# EAGLE schematic D-DAQ Mainboard - Revised (EAGLE 6.6.0)
D-DAQ PIC32MX-controlled modular data aquisition and display
REVISION: 1
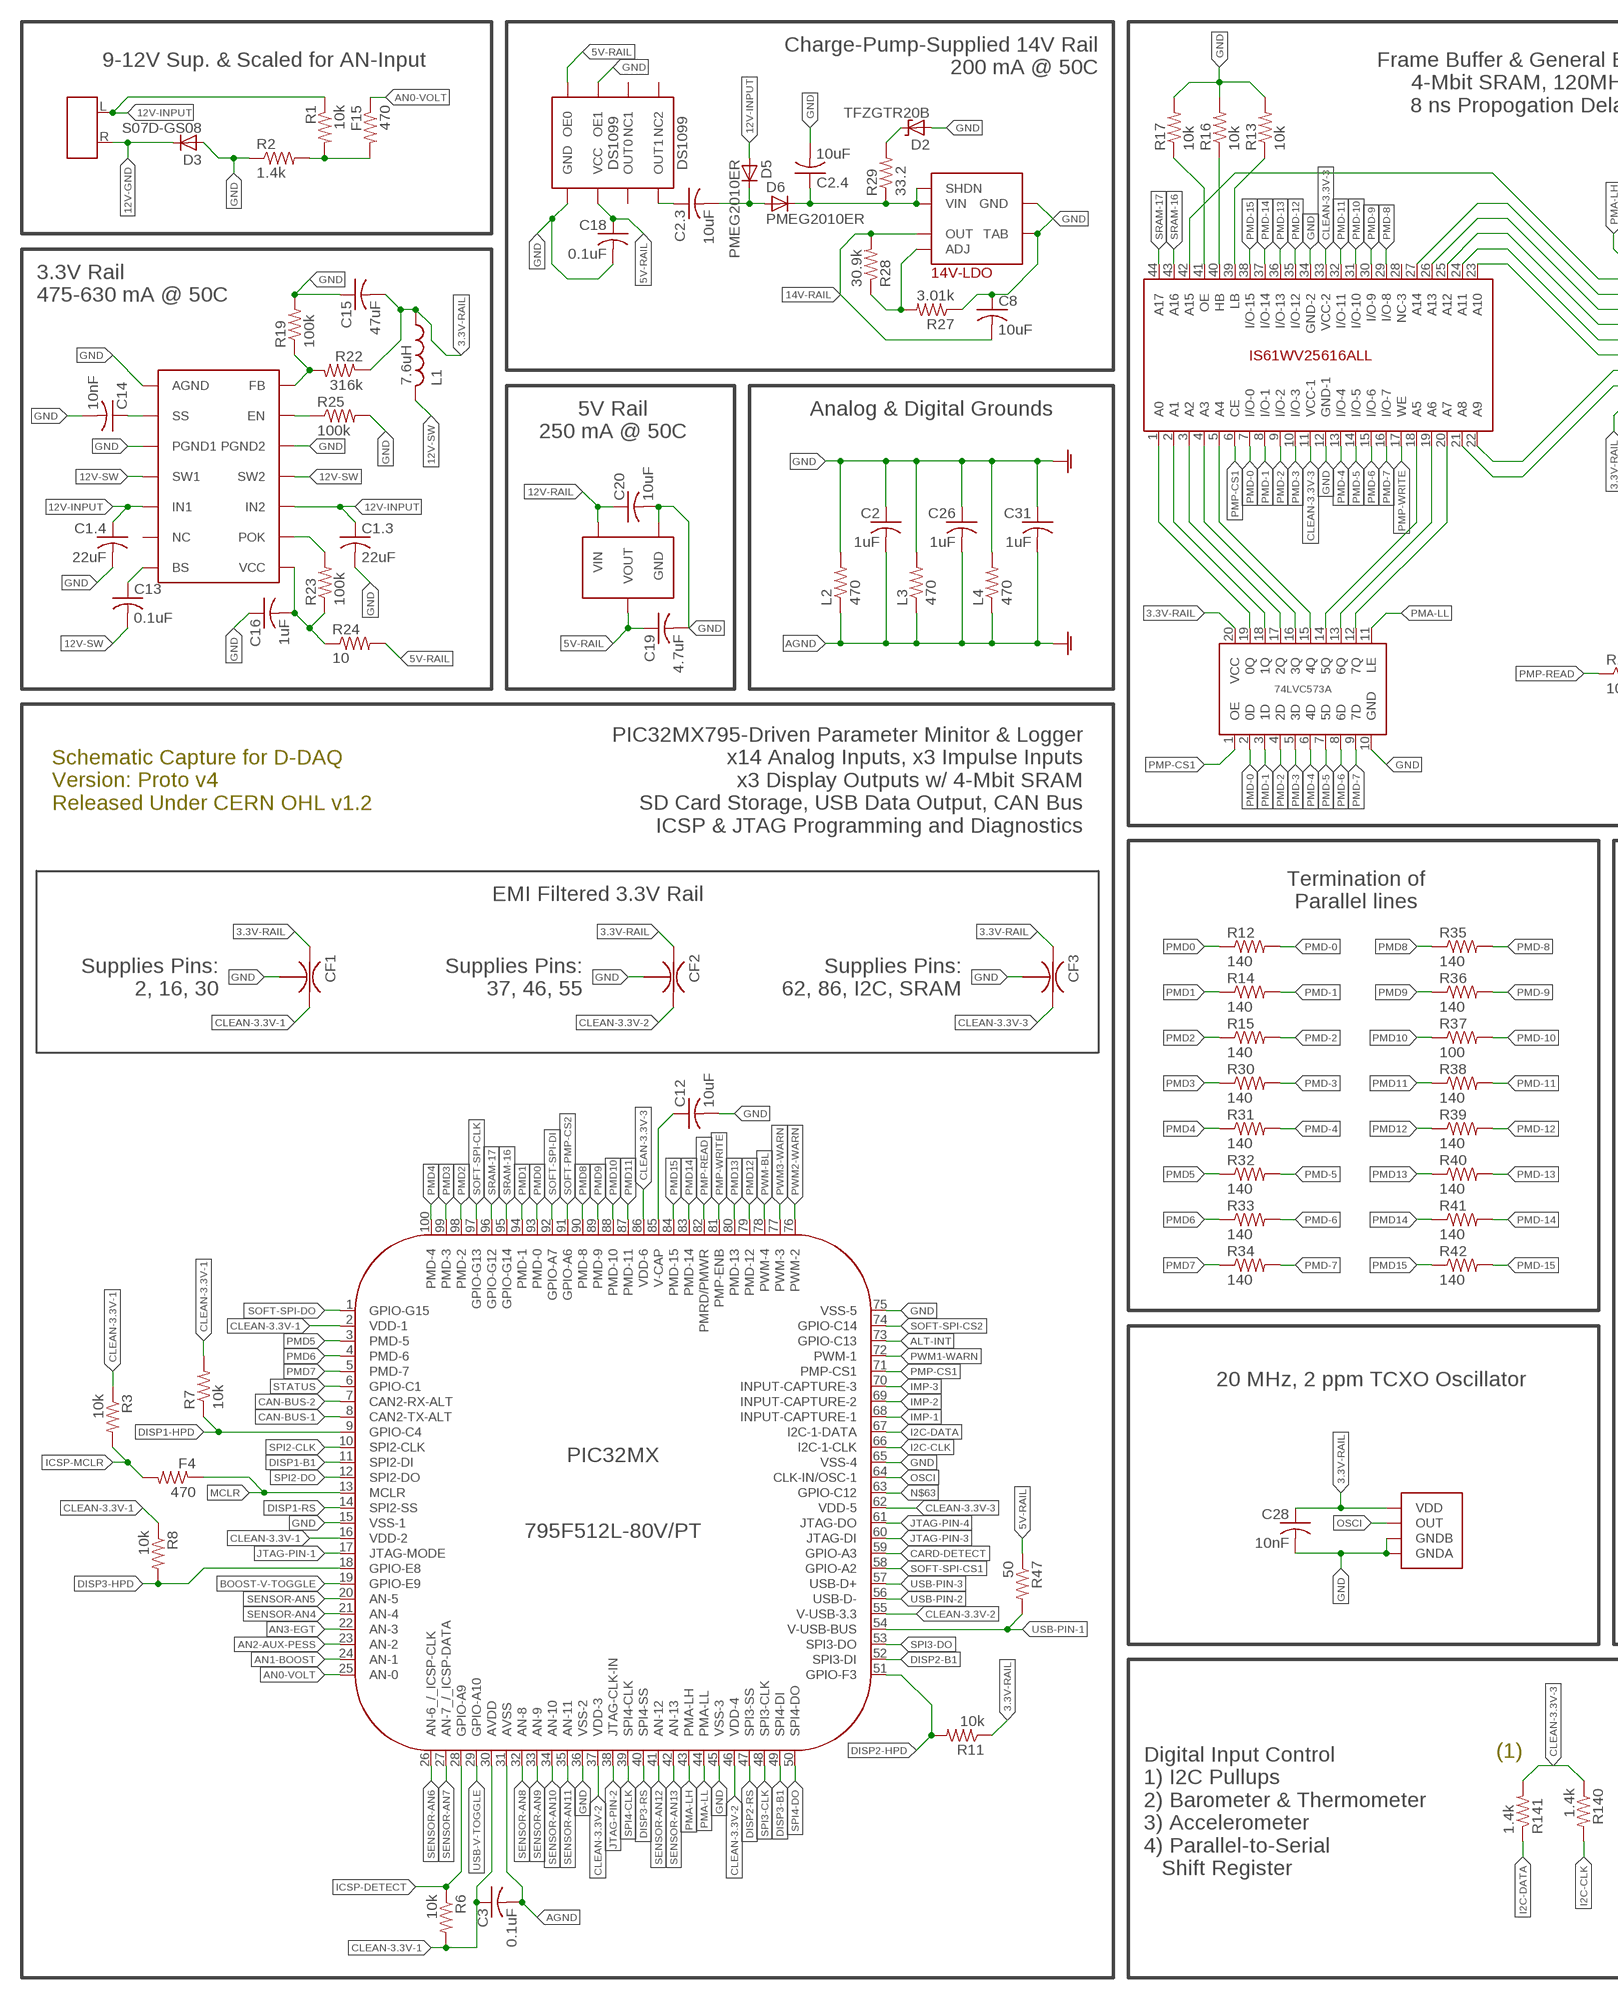
[diagram p0: schematic, sheet 1, part 1 of 2]
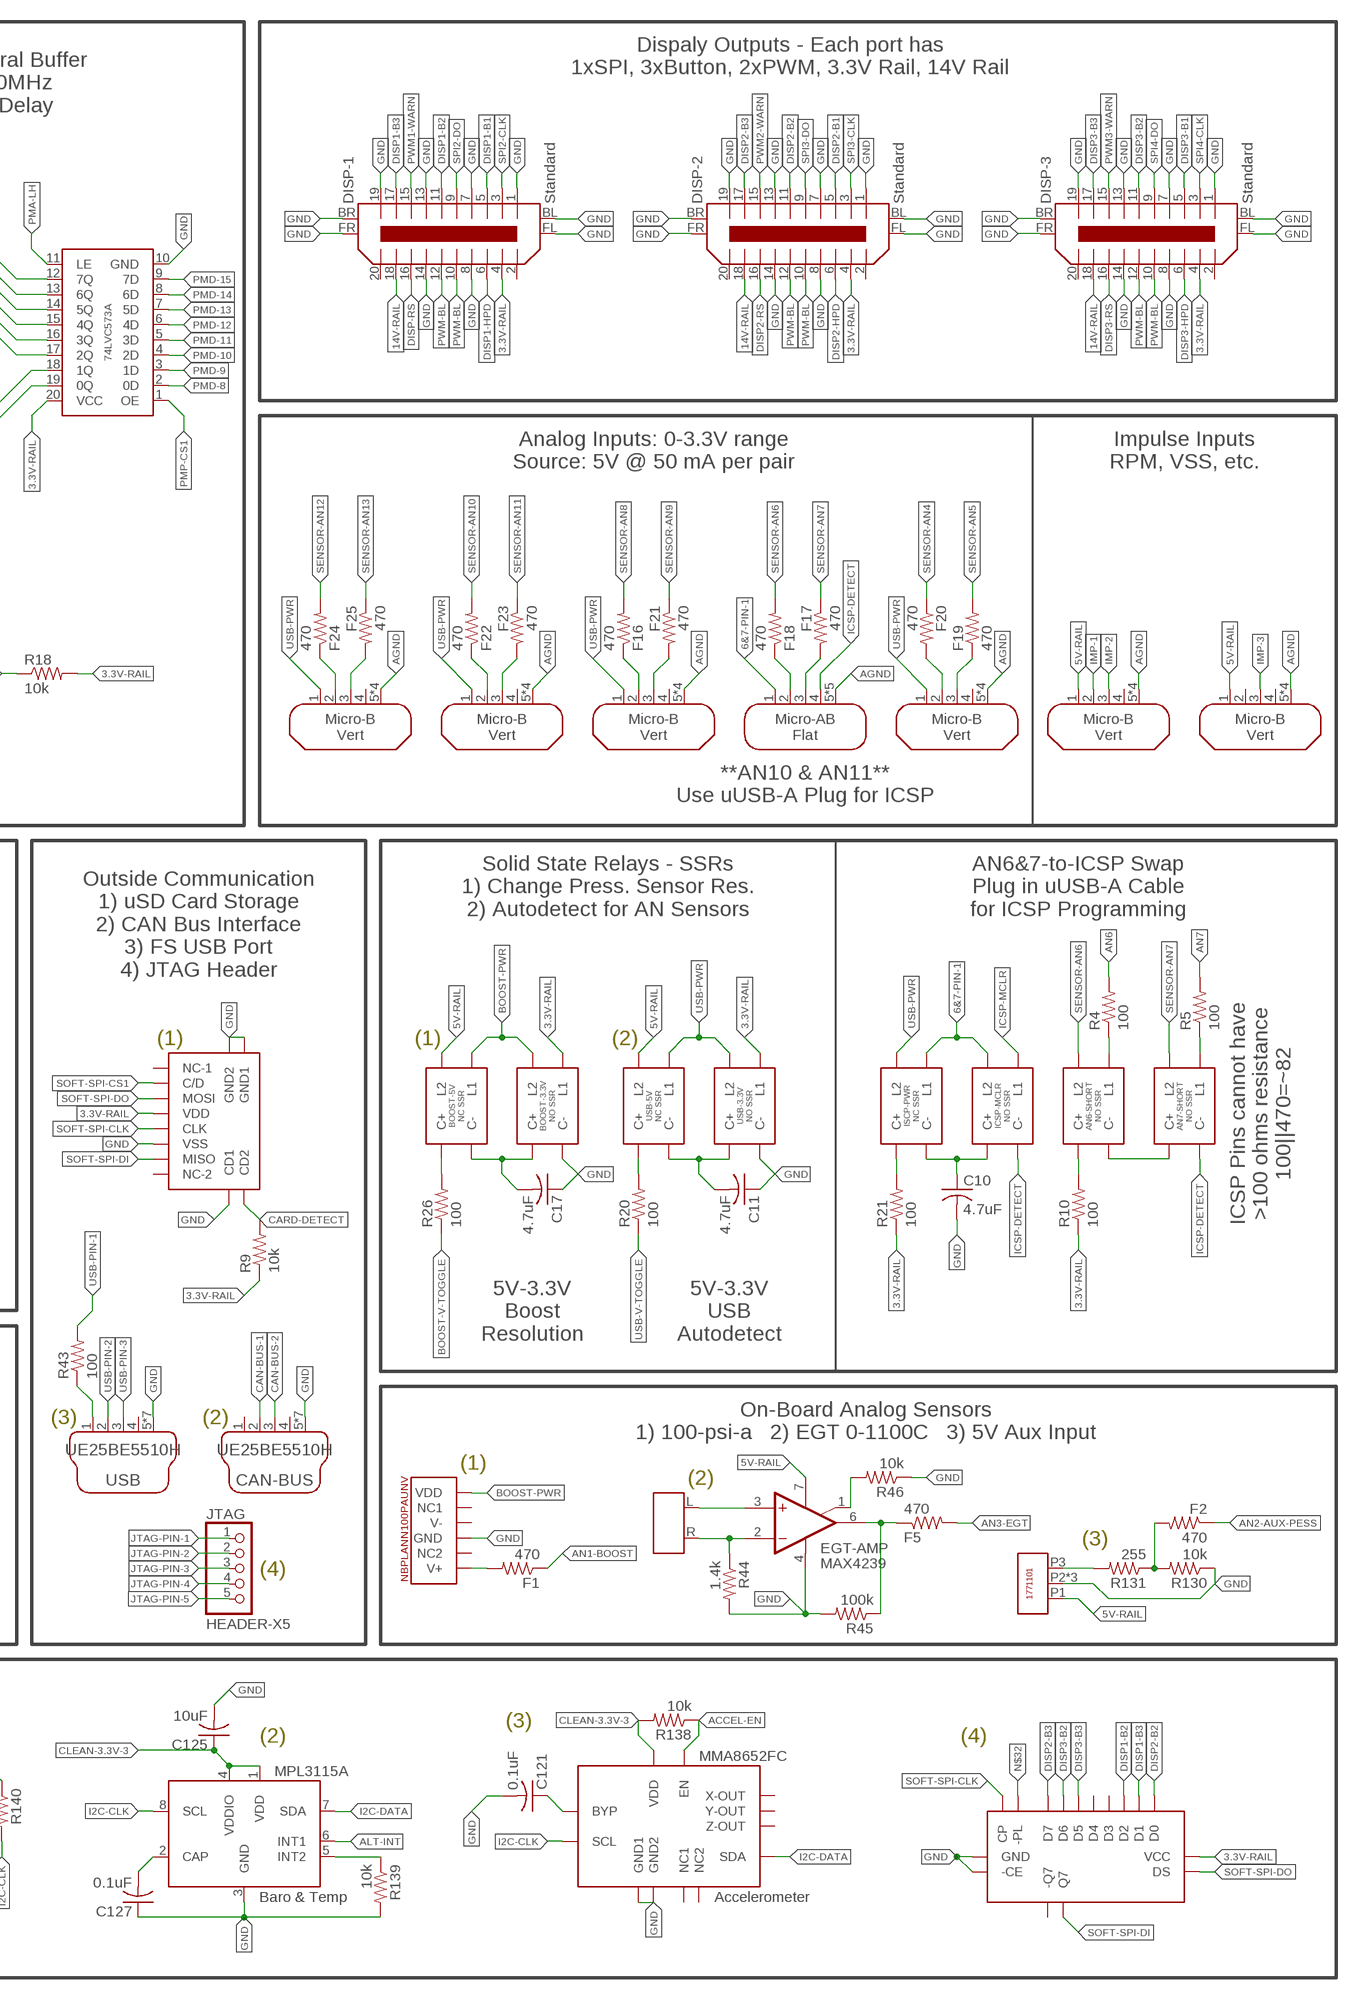
[diagram p1: schematic, sheet 1, part 2 of 2]

## Parts
4&5  Micro USB  105133-0001  [USB-MICRO-B-VERT]
5V-LDO  ZLDO1117-5.0  ZLDO1117-ADJ  [SOT-223-4]
6&7+  Micro USB  47589-0001  [USB-MICRO-AB-FLAT]
8&9  Micro USB  105133-0001  [USB-MICRO-B-VERT]
10&11  Micro USB  105133-0001  [USB-MICRO-B-VERT]
12&13  Micro USB  105133-0001  [USB-MICRO-B-VERT]
14V-LDO  TL1963ADCQR  [SOT-223-6]
AN6-SHORT  NO SSR  CPC1017N  [SOP-4-NO]
AN7-SHORT  NO SSR  CPC1017N  [SOP-4-NO]
AUX-PRESS  PC-1771101  [PC-1771101]
BOOST-3.3V  NO SSR  CPC1017N  [SOP-4-NO]
BOOST-5V  NC SSR  CPC1117N  [SOP-4-NC]
C1.3  22uF  C-1812  [SMD-1812-EDGE]
C1.4  22uF  C-1812  [SMD-1812-EDGE]
C2  1uF  C-0603  [SMD-0603]
C2.3  10uF  C-1210  [SMD-1210]
C2.4  10uF  C-1210  [SMD-1210]
C3  0.1uF  C-0603  [SMD-0603]
C8  10uF  C-1210  [SMD-1210]
C10  4.7uF  C-0603  [SMD-0603]
C11  4.7uF  C-0603  [SMD-0603]
C12  10uF  C-0805  [SMD-0805]
C13  0.1uF  C-0603  [SMD-0603]
C14  10nF  C-0603  [SMD-0603]
C15  47uF  C-1210  [SMD-1210]
C16  1uF  C-0603  [SMD-0603]
C17  4.7uF  C-0603  [SMD-0603]
C18  0.1uF  C-0603  [SMD-0603]
C19  4.7uF  C-1206  [SMD-1206]
C20  10uF  C-1210  [SMD-1210]
C26  1uF  C-0603  [SMD-0603]
C28  10nF  C-0603  [SMD-0603]
C31  1uF  C-0603  [SMD-0603]
C121  0.1uF  C-0603  [SMD-0603]
C125  10uF  C-0805  [SMD-0805]
C127  0.1uF  C-0603  [SMD-0603]
CAN-BUS  UE25BE5510H  UE25-BE55-10H  [USB-MINI-B-VERT]
CF1  NMF21PS  [NFM21PS]
CF2  NMF21PS  [NFM21PS]
CF3  NMF21PS  [NFM21PS]
D2  TFZGTR20B  [TUMD2]
D3  S07D-GS08  S07D  [DO-219AB-2]
D5  PMEG2010ER  S07D  [DO-219AB-2]
D6  PMEG2010ER  S07D  [DO-219AB-2]
DISP-1  Standard  DP3R020SU32JQ  [JAE-MDP-STD]
DISP-2  Standard  DP3R020SU32JQ  [JAE-MDP-STD]
DISP-3  Standard  DP3R020SU32JQ  [JAE-MDP-STD]
EGT-AMP  MAX4239  [SOT-8]
EGT-INPUT  PC-1702610  [PC-1702610]
F1  470  R-0603  [SMD-0603]
F2  470  R-0603  [SMD-0603]
F4  470  R-0603  [SMD-0603]
F5  470  R-0603  [SMD-0603]
F15  470  R-0603  [SMD-0603]
F16  470  R-0603  [SMD-0603]
F17  470  R-0603  [SMD-0603]
F18  470  R-0603  [SMD-0603]
F19  470  R-0603  [SMD-0603]
F20  470  R-0603  [SMD-0603]
F21  470  R-0603  [SMD-0603]
F22  470  R-0603  [SMD-0603]
F23  470  R-0603  [SMD-0603]
F24  470  R-0603  [SMD-0603]
F25  470  R-0603  [SMD-0603]
ICSP-MCLR  NO SSR  CPC1017N  [SOP-4-NO]
IMP-1  Micro USB  105133-0001  [USB-MICRO-B-VERT]
IMP-2  Micro USB  105133-0001  [USB-MICRO-B-VERT]
ISCP-PWR  NC SSR  CPC1117N  [SOP-4-NC]
JTAG  HEADER-X5  [HEADER-X5]
L1  7.6uH  WE-INDUCTOR  [7443551XXX]
L2  470  R-0603  [SMD-0603]
L3  470  R-0603  [SMD-0603]
L4  470  R-0603  [SMD-0603]
LATCH-HIGH  Octal D-Latch  74LVC573A  [TSSOP-20]
LATCH-LOW  Octal D-Latch  74LVC573A  [TSSOP-20]
MICRO-SD  47579-0001  MICRO-SD-SLOT  [MOLEX-47579001]
MMA8652FC  Accelerometer  MMA8491Q  [QFN-12]
MPL3115A  Baro & Temp  MPL3115A2  [LGA-8]
NBPLANN100PAUNV  Boost  NBP-SENSORS  [LEADLESS-SMT]
PIC32MX  795F512L-80V/PT  PIC32MX795F512L-80I/PF  [TQFP-100-14X14]
POWER  PC-1702610  [PC-1702610]
R1  10k  R-0603  [SMD-0603]
R2  1.4k  R-0603  [SMD-0603]
R3  10k  R-0603  [SMD-0603]
R4  100  R-0603  [SMD-0603]
R5  100  R-0603  [SMD-0603]
R6  10k  R-0603  [SMD-0603]
R7  10k  R-0603  [SMD-0603]
R8  10k  R-0603  [SMD-0603]
R9  10k  R-0603  [SMD-0603]
R10  100  R-0603  [SMD-0603]
R11  10k  R-0603  [SMD-0603]
R12  140  R-0603  [SMD-0603]
R13  10k  R-0603  [SMD-0603]
R14  140  R-0603  [SMD-0603]
R15  140  R-0603  [SMD-0603]
R16  10k  R-0603  [SMD-0603]
R17  10k  R-0603  [SMD-0603]
R18  10k  R-0603  [SMD-0603]
R19  100k  R-0603  [SMD-0603]
R20  100  R-0603  [SMD-0603]
R21  100  R-0603  [SMD-0603]
R22  316k  R-0603  [SMD-0603]
R23  100k  R-0603  [SMD-0603]
R24  10  R-0603  [SMD-0603]
R25  100k  R-0603  [SMD-0603]
R26  100  R-0603  [SMD-0603]
R27  3.01k  R-0603  [SMD-0603]
R28  30.9k  R-0603  [SMD-0603]
R29  33.2  R-0603  [SMD-0603]
R30  140  R-0603  [SMD-0603]
R31  140  R-0603  [SMD-0603]
R32  140  R-0603  [SMD-0603]
R33  140  R-0603  [SMD-0603]
R34  140  R-0603  [SMD-0603]
R35  140  R-0603  [SMD-0603]
R36  140  R-0603  [SMD-0603]
R37  100  R-0603  [SMD-0603]
R38  140  R-0603  [SMD-0603]
R39  140  R-0603  [SMD-0603]
R40  140  R-0603  [SMD-0603]
R41  140  R-0603  [SMD-0603]
R42  140  R-0603  [SMD-0603]
R43  100  R-0603  [SMD-0603]
R44  1.4k  R-0603  [SMD-0603]
R45  100k  R-0603  [SMD-0603]
R46  10k  R-0603  [SMD-0603]
R47  50  R-0603  [SMD-0603]
R130  10k  R-0603  [SMD-0603]
R131  255  R-0603  [SMD-0603]
R138  10k  R-0603  [SMD-0603]
R139  10k  R-0603  [SMD-0603]
R140  1.4k  R-0603  [SMD-0603]
R141  1.4k  R-0603  [SMD-0603]
SHIFT-REGISTER  NXP-74HC165  [DHVQFN16]
SMPS  MP2209  [QFN-14]
SRAM  IS61WV25616ALL  [TSOP-44]
USB  UE25BE5510H  UE25-BE55-10H  [USB-MINI-B-VERT]
USB-3.3V  NO SSR  CPC1017N  [SOP-4-NO]
USB-5V  NC SSR  CPC1117N  [SOP-4-NC]
Y1  XTC7009  [3.2X2.5MM]
Y2  DS1099  [SOIC-8]

## Nets
3.3V-RAIL [power-hi]: BOOST-3.3V.3(L1) C15.2 C28.1 CF1.1 CF2.1 CF3.1 DISP-1.4 DISP-2.4 DISP-3.4 L1.P$2 LATCH-HIGH.20(VCC) LATCH-LOW.20(VCC) MICRO-SD.4(VDD) R9.1 R10.1 R11.1 R18.2 R21.1 R22.1 SHIFT-REGISTER.VCC USB-3.3V.3(L1) Y1.P$4(VDD)
5V-RAIL [power-low]: 5V-LDO.VOUT 5V-LDO.VOUT-1(VOUT) AUX-PRESS.P1 BOOST-5V.4(L2) C18.1 C19.1 EGT-AMP.7(V+) IMP-1.1 IMP-2.1 R24.2 R47.1 USB-5V.4(L2) Y2.3(VCC) Y2.5(OE0)
6&7-PIN-1 [analog]: 6&7+.1 ICSP-MCLR.4(L2) ISCP-PWR.3(L1)
12V-BS1: C13.1 SMPS.7(BS)
12V-ENABLE [digital]: R25.1 SMPS.13(EN)
12V-FB1 [digital]: R19.1 R22.2 SMPS.P14(FB)
12V-GND [power-hi]: D3.P$2(C) POWER.R
12V-INPUT [power-hi]: C1.3.1 C1.4.1 D5.P$1(A) POWER.L R1.1 SMPS.5(IN1) SMPS.10(IN2)
12V-OK1 [digital]: R23.2 SMPS.9(POK)
12V-RAIL: 5V-LDO.VIN C20.1
12V-SS [digital]: C14.1 SMPS.2(SS)
12V-SW [digital]: C13.2 L1.P$1 SMPS.4(SW1) SMPS.11(SW2)
12V-VCC1 [digital]: C16.2 R23.1 R24.1 SMPS.8(VCC)
14V-12V-DIVIDER1: F15.2 R1.2 R2.2
14V-ADJ1: 14V-LDO.ADJ R27.2 R28.1
14V-INPUT: C2.4.1 D6.P$2(C)
14V-INPUT1 [power-hi]: 14V-LDO.SHDN 14V-LDO.VIN R29.1
14V-RAIL [power-med]: 14V-LDO.VOUT(OUT) C8.2 DISP-1.18 DISP-2.18 DISP-3.18 R28.2
ACCEL-BYP: C121.1 MMA8652FC.1(BYP)
ACCEL-EN: MMA8652FC.4(EN) R138.1
ADT-1 [digital]: BOOST-5V.1(C+) R26.2
ADT-2 [digital]: R20.2 USB-5V.1(C+)
ADT-3 [digital]: ISCP-PWR.1(C+) R21.2
ADT-4 [digital]: AN6-SHORT.1(C+) R10.2
AGND [analog]: 4&5.5 4&5.T0 4&5.T1 4&5.T2 6&7+.5 6&7+.B1 6&7+.B2 6&7+.F1 6&7+.F2 8&9.5 8&9.T0 8&9.T1 8&9.T2 10&11.5 10&11.T0 10&11.T1 10&11.T2 12&13.5 12&13.T0 12&13.T1 12&13.T2 C2.2 C3.2 C26.2 C31.2 IMP-1.5 IMP-1.T0 IMP-1.T1 IMP-1.T2 IMP-2.5 IMP-2.T0 IMP-2.T1 IMP-2.T2 L2.1 L3.1 L4.1 PIC32MX.31(AVSS)
ALT-INT [digital]: MPL3115A.6(INT1) PIC32MX.73(GPIO-C13)
AN0-VOLT [analog]: F15.1 PIC32MX.25(AN-0)
AN1-BOOST [analog]: F1.1 PIC32MX.24(AN-1)
AN2-AUX-PESS [analog]: F2.1 PIC32MX.23(AN-2)
AN3-EGT [analog]: F5.2 PIC32MX.22(AN-3)
AN4: 4&5.2 F20.2
AN5: 4&5.3 F19.1
AN6 [analog]: 6&7+.2 F18.1 R4.2
AN7 [analog]: 6&7+.3 F17.2 R5.2
AN8 [analog]: 8&9.2 F16.1
AN9 [analog]: 8&9.3 F21.2
AN10 [analog]: 10&11.2 F22.1
AN11 [analog]: 10&11.3 F23.2
AN12 [analog]: 12&13.2 F24.1
AN13 [analog]: 12&13.3 F25.2
AUX-OUT: F2.2 R130.2 R131.1
BARO-INT2: MPL3115A.5(INT2) R139.1
BOOST-OUT: F1.2 NBPLANN100PAUNV.6(V+)
BOOST-PWR [digital]: BOOST-3.3V.4(L2) BOOST-5V.3(L1) NBPLANN100PAUNV.1(VDD)
BOOST-SSR [digital]: BOOST-3.3V.1(C+) BOOST-5V.2(C-) C17.2
BOOST-V-TOGGLE [digital]: PIC32MX.19(GPIO-E9) R26.1
CAN-BUS-1 [digital]: CAN-BUS.2 PIC32MX.8(CAN2-TX-ALT)
CAN-BUS-2 [digital]: CAN-BUS.3 PIC32MX.7(CAN2-RX-ALT)
CARD-DETECT [digital]: MICRO-SD.G4(CD2) PIC32MX.59(GPIO-A3) R9.2
CHARG-CAPS: C2.3.1 Y2.1(OUT1)
CLEAN-3.3V-1 [power-low]: C3.1 CF1.3 PIC32MX.2(VDD-1) PIC32MX.16(VDD-2) PIC32MX.30(AVDD) R3.1 R6.2 R7.2 R8.1
CLEAN-3.3V-2 [power-low]: CF2.3 PIC32MX.37(VDD-3) PIC32MX.46(VDD-4) PIC32MX.55(V-USB-3.3)
CLEAN-3.3V-3 [power-low]: C125.1 CF3.3 MMA8652FC.2(VDD) MPL3115A.1(VDD) MPL3115A.4(VDDIO) PIC32MX.62(VDD-5) PIC32MX.86(VDD-6) R138.2 R140.1 R141.2 SRAM.11(VCC-1) SRAM.33(VCC-2)
CP-PUMP1: C2.3.2 D5.P$2(C) D6.P$1(A)
DISP1-B1 [digital]: DISP-1.5 PIC32MX.11(SPI2-DI)
DISP1-B2 [digital]: DISP-1.11 SHIFT-REGISTER.D2
DISP1-B3 [digital]: DISP-1.17 SHIFT-REGISTER.D1
DISP1-HPD [digital]: DISP-1.6 PIC32MX.9(GPIO-C4) R7.1
DISP1-RS [digital]: PIC32MX.14(SPI2-SS)
DISP2-B1 [digital]: DISP-2.5 PIC32MX.52(SPI3-DI)
DISP2-B2 [digital]: DISP-2.11 SHIFT-REGISTER.D0
DISP2-B3 [digital]: DISP-2.17 SHIFT-REGISTER.D7
DISP2-HPD [digital]: DISP-2.6 PIC32MX.51(GPIO-F3) R11.2
DISP2-RS [digital]: DISP-2.16 PIC32MX.47(SPI3-SS)
DISP3-B1 [digital]: DISP-3.5 PIC32MX.49(SPI4-DI)
DISP3-B2 [digital]: DISP-3.11 SHIFT-REGISTER.D6
DISP3-B3 [digital]: DISP-3.17 SHIFT-REGISTER.D5
DISP3-HPD [digital]: DISP-3.6 PIC32MX.18(GPIO-E8) R8.2
DISP3-RS [digital]: DISP-3.16 PIC32MX.40(SPI4-SS)
DISP-RS [digital]: DISP-1.16
EGT-NEG-IN: EGT-AMP.2(-IN) EGT-INPUT.R R44.1
EGT-OUT: EGT-AMP.6(OUT1) F5.1 R45.1
EGT-POS-IN: EGT-AMP.3(+IN) EGT-INPUT.L
EGT-SHDN: EGT-AMP.1(CRETN) R46.2
GND [analog]: 5V-LDO.ADJ(GND) 14V-LDO.GND 14V-LDO.TAB AUX-PRESS.P2 AUX-PRESS.T0 AUX-PRESS.T1 BOOST-3.3V.2(C-) C1.3.2 C1.4.2 C2.1 C2.4.2 C8.1 C10.2 C11.1 C12.2 C14.2 C15.1 C16.1 C17.1 C18.2 C19.2 C20.2 C26.1 C28.2 C31.1 C121.2 C125.2 C127.1 CAN-BUS.5 CAN-BUS.P$1 CAN-BUS.P$2 CAN-BUS.P$3 CAN-BUS.P$4 CAN-BUS.T0 CAN-BUS.T1 CF1.2@1 CF2.2@1 CF3.2@1 D2.P$1(A) D3.P$1(A) DISP-1.1 DISP-1.7 DISP-1.8 DISP-1.13 DISP-1.14 DISP-1.19 DISP-1.BL DISP-1.BR DISP-1.FL DISP-1.FR DISP-2.1 DISP-2.7 DISP-2.8 DISP-2.13 DISP-2.14 DISP-2.19 DISP-2.BL DISP-2.BR DISP-2.FL DISP-2.FR DISP-3.1 DISP-3.7 DISP-3.8 DISP-3.13 DISP-3.14 DISP-3.19 DISP-3.BL DISP-3.BR DISP-3.FL DISP-3.FR EGT-AMP.4(V-) L2.2 L3.2 L4.2 LATCH-HIGH.10(GND) LATCH-LOW.10(GND) MICRO-SD.6(VSS) MICRO-SD.G1(GND1) MICRO-SD.G2(GND2) MICRO-SD.G3(CD1) MMA8652FC.6(GND1) MMA8652FC.7(GND2) MPL3115A.3(GND) NBPLANN100PAUNV.4(GND) PIC32MX.15(VSS-1) PIC32MX.36(VSS-2) PIC32MX.45(VSS-3) PIC32MX.65(VSS-4) PIC32MX.75(VSS-5) R2.1 R13.2 R16.2 R17.2 R19.2 R25.2 R27.1 R44.2 R45.2 R46.1 R130.1 R139.2 SHIFT-REGISTER.-CE SHIFT-REGISTER.GND SHIFT-REGISTER.GND2(GND) SMPS.1(AGND) SMPS.3(PGND1) SMPS.12(PGND2) SMPS.P$15(AGND) SRAM.12(GND-1) SRAM.34(GND-2) USB-3.3V.2(C-) USB.5 USB.P$1 USB.P$2 USB.P$3 USB.P$4 USB.T0 USB.T1 Y1.P$1(GNDA) Y1.P$2(GNDB) Y2.4(GND) Y2.6(OE1)
HB-PD: R16.1 SRAM.40(HB)
I2C-CLK [digital]: MMA8652FC.5(SCL) MPL3115A.8(SCL) PIC32MX.66(I2C-1-CLK) R140.2
I2C-DATA [digital]: MMA8652FC.3(SDA) MPL3115A.7(SDA) PIC32MX.67(I2C-1-DATA) R141.1
ICSP-DETECT [digital]: 6&7+.4 AN7-SHORT.2(C-) ICSP-MCLR.2(C-) PIC32MX.28(GPIO-A9) R6.1
ICSP-MCLR [digital]: F4.2 ICSP-MCLR.3(L1) R3.2
ICSP-SSR [digital]: C10.1 ICSP-MCLR.1(C+) ISCP-PWR.2(C-)
IMP-1 [digital]: IMP-1.2 PIC32MX.68(INPUT-CAPTURE-1)
IMP-2 [digital]: IMP-1.3 PIC32MX.69(INPUT-CAPTURE-2)
IMP-3 [digital]: IMP-2.3 PIC32MX.70(INPUT-CAPTURE-3)
JTAG-PIN-1 [digital]: JTAG.1 PIC32MX.17(JTAG-MODE)
JTAG-PIN-2 [digital]: JTAG.2 PIC32MX.38(JTAG-CLK-IN)
JTAG-PIN-3 [digital]: JTAG.3 PIC32MX.60(JTAG-DI)
JTAG-PIN-4 [digital]: JTAG.4 PIC32MX.61(JTAG-DO)
JTAG-PIN-5 [digital]: JTAG.5
LB-PD: R13.1 SRAM.39(LB)
LOAD-AN6: AN6-SHORT.3(L1) R4.1
LOAD-AN7: AN7-SHORT.3(L1) R5.1
MCLR [digital]: F4.1 PIC32MX.13(MCLR)
MPL-BYP-CAP: C127.2 MPL3115A.2(CAP)
N$22 [digital]: AN6-SHORT.2(C-) AN7-SHORT.1(C+)
N$32: SHIFT-REGISTER.-PL
N$63: PIC32MX.63(GPIO-C12)
OE-PD: R17.1 SRAM.41(OE)
OIL-PRESS-OUT: AUX-PRESS.P3 R131.2
OSCI [analog]: PIC32MX.64(CLK-IN/OSC-1) Y1.P$3(OUT)
PMA-LH [digital]: LATCH-HIGH.11(LE) PIC32MX.43(PMA-LH)
PMA-LL [digital]: LATCH-LOW.11(LE) PIC32MX.44(PMA-LL)
PMD0 [digital]: PIC32MX.93(PMD-0) R12.1
PMD1 [digital]: PIC32MX.94(PMD-1) R14.1
PMD2 [digital]: PIC32MX.98(PMD-2) R15.1
PMD3 [digital]: PIC32MX.99(PMD-3) R30.1
PMD4 [digital]: PIC32MX.100(PMD-4) R31.1
PMD5 [digital]: PIC32MX.3(PMD-5) R32.1
PMD6 [digital]: PIC32MX.4(PMD-6) R33.1
PMD7 [digital]: PIC32MX.5(PMD-7) R34.1
PMD8 [digital]: PIC32MX.90(PMD-8) R35.1
PMD9 [digital]: PIC32MX.89(PMD-9) R36.1
PMD10 [digital]: PIC32MX.88(PMD-10) R37.1
PMD11 [digital]: PIC32MX.87(PMD-11) R38.1
PMD12 [digital]: PIC32MX.79(PMD-12) R39.1
PMD13 [digital]: PIC32MX.80(PMD-13) R40.1
PMD14 [digital]: PIC32MX.83(PMD-14) R41.1
PMD15 [digital]: PIC32MX.84(PMD-15) R42.1
PMD-0 [digital]: LATCH-LOW.2(0D) R12.2 SRAM.7(I/O-0)
PMD-1 [digital]: LATCH-LOW.3(1D) R14.2 SRAM.8(I/O-1)
PMD-2 [digital]: LATCH-LOW.4(2D) R15.2 SRAM.9(I/O-2)
PMD-3 [digital]: LATCH-LOW.5(3D) R30.2 SRAM.10(I/O-3)
PMD-4 [digital]: LATCH-LOW.6(4D) R31.2 SRAM.13(I/O-4)
PMD-5 [digital]: LATCH-LOW.7(5D) R32.2 SRAM.14(I/O-5)
PMD-6 [digital]: LATCH-LOW.8(6D) R33.2 SRAM.15(I/O-6)
PMD-7 [digital]: LATCH-LOW.9(7D) R34.2 SRAM.16(I/O-7)
PMD-8 [digital]: LATCH-HIGH.2(0D) R35.2 SRAM.29(I/O-8)
PMD-9 [digital]: LATCH-HIGH.3(1D) R36.2 SRAM.30(I/O-9)
PMD-10 [digital]: LATCH-HIGH.4(2D) R37.2 SRAM.31(I/O-10)
PMD-11 [digital]: LATCH-HIGH.5(3D) R38.2 SRAM.32(I/O-11)
PMD-12 [digital]: LATCH-HIGH.6(4D) R39.2 SRAM.35(I/O-12)
PMD-13 [digital]: LATCH-HIGH.7(5D) R40.2 SRAM.36(I/O-13)
PMD-14 [digital]: LATCH-HIGH.8(6D) R41.2 SRAM.37(I/O-14)
PMD-15 [digital]: LATCH-HIGH.9(7D) R42.2 SRAM.38(I/O-15)
PMP-CS1 [digital]: LATCH-HIGH.1(OE) LATCH-LOW.1(OE) PIC32MX.71(PMP-CS1) SRAM.6(CE)
PMP-READ [digital]: PIC32MX.82(PMRD/PMWR) R18.1
PMP-WRITE [digital]: PIC32MX.81(PMP-ENB) SRAM.17(WE)
PWM1-WARN [digital]: DISP-1.15 PIC32MX.72(PWM-1)
PWM2-WARN: DISP-2.15 PIC32MX.76(PWM-2)
PWM3-WARN [digital]: DISP-3.15 PIC32MX.77(PWM-3)
PWM-BL [digital]: DISP-1.10 DISP-1.12 DISP-2.10 DISP-2.12 DISP-3.10 DISP-3.12 PIC32MX.78(PWM-4)
SENSOR-AN4 [analog]: F20.1 PIC32MX.21(AN-4)
SENSOR-AN5 [analog]: F19.2 PIC32MX.20(AN-5)
SENSOR-AN6 [analog]: AN6-SHORT.4(L2) F18.2 PIC32MX.26(AN-6_/_ICSP-CLK)
SENSOR-AN7 [analog]: AN7-SHORT.4(L2) F17.1 PIC32MX.27(AN-7_/_ICSP-DATA)
SENSOR-AN8 [analog]: F16.2 PIC32MX.32(AN-8)
SENSOR-AN9 [analog]: F21.1 PIC32MX.33(AN-9)
SENSOR-AN10 [analog]: F22.2 PIC32MX.34(AN-10)
SENSOR-AN11 [analog]: F23.1 PIC32MX.35(AN-11)
SENSOR-AN12 [analog]: F24.2 PIC32MX.41(AN-12)
SENSOR-AN13 [analog]: F25.1 PIC32MX.42(AN-13)
SHUNT1: D2.P$2(C) R29.2
SOFT-PMP-CS2 [digital]: PIC32MX.91(GPIO-A6)
SOFT-SPI-CLK [digital]: MICRO-SD.5(CLK) PIC32MX.97(GPIO-G13) SHIFT-REGISTER.CP
SOFT-SPI-CS1 [digital]: MICRO-SD.2(C/D) PIC32MX.58(GPIO-A2)
SOFT-SPI-CS2 [digital]: PIC32MX.74(GPIO-C14)
SOFT-SPI-DI [digital]: MICRO-SD.7(MISO) PIC32MX.92(GPIO-A7) SHIFT-REGISTER.Q7
SOFT-SPI-DO [digital]: MICRO-SD.3(MOSI) PIC32MX.1(GPIO-G15) SHIFT-REGISTER.DS
SPI2-CLK [digital]: DISP-1.3 PIC32MX.10(SPI2-CLK)
SPI2-DO [digital]: DISP-1.9 PIC32MX.12(SPI2-DO)
SPI3-CLK [digital]: DISP-2.3 PIC32MX.48(SPI3-CLK)
SPI3-DO [digital]: DISP-2.9 PIC32MX.53(SPI3-DO)
SPI4-CLK [digital]: DISP-3.3 PIC32MX.39(SPI4-CLK)
SPI4-DO [digital]: DISP-3.9 PIC32MX.50(SPI4-DO)
SRAM-0 [digital]: LATCH-LOW.19(0Q) SRAM.1(A0)
SRAM-1 [digital]: LATCH-LOW.18(1Q) SRAM.2(A1)
SRAM-2 [digital]: LATCH-LOW.17(2Q) SRAM.3(A2)
SRAM-3 [digital]: LATCH-LOW.16(3Q) SRAM.4(A3)
SRAM-4 [digital]: LATCH-LOW.15(4Q) SRAM.5(A4)
SRAM-5 [digital]: LATCH-LOW.14(5Q) SRAM.18(A5)
SRAM-6 [digital]: LATCH-LOW.13(6Q) SRAM.19(A6)
SRAM-7 [digital]: LATCH-LOW.12(7Q) SRAM.20(A7)
SRAM-8 [digital]: LATCH-HIGH.19(0Q) SRAM.21(A8)
SRAM-9 [digital]: LATCH-HIGH.18(1Q) SRAM.22(A9)
SRAM-10 [digital]: LATCH-HIGH.17(2Q) SRAM.23(A10)
SRAM-11 [digital]: LATCH-HIGH.16(3Q) SRAM.24(A11)
SRAM-12 [digital]: LATCH-HIGH.15(4Q) SRAM.25(A12)
SRAM-13 [digital]: LATCH-HIGH.14(5Q) SRAM.26(A13)
SRAM-14 [digital]: LATCH-HIGH.13(6Q) SRAM.27(A14)
SRAM-15 [digital]: LATCH-HIGH.12(7Q) SRAM.42(A15)
SRAM-16 [digital]: PIC32MX.95(GPIO-G14) SRAM.43(A16)
SRAM-17 [digital]: PIC32MX.96(GPIO-G12) SRAM.44(A17)
STATUS [digital]: PIC32MX.6(GPIO-C1)
USB-PIN1 [digital]: R43.1 USB.1
USB-PIN-1: PIC32MX.54(V-USB-BUS) R43.2 R47.2
USB-PIN-2 [digital]: PIC32MX.56(USB-D-) USB.2
USB-PIN-3 [digital]: PIC32MX.57(USB-D+) USB.3
USB-PWR [analog]: 4&5.1 8&9.1 10&11.1 12&13.1 ISCP-PWR.4(L2) USB-3.3V.4(L2) USB-5V.3(L1)
USB-SSR [digital]: C11.2 USB-3.3V.1(C+) USB-5V.2(C-)
USB-V-TOGGLE [digital]: PIC32MX.29(GPIO-A10) R20.1
V-CAP: C12.1 PIC32MX.85(V-CAP)
Unconnected: 4&5.4 8&9.4 10&11.4 12&13.4 CAN-BUS.4 CF1.2@2 CF2.2@2 CF3.2@2 DISP-1.2 DISP-1.20 DISP-2.2 DISP-2.20 DISP-3.2 DISP-3.20 IMP-1.4 IMP-2.2 IMP-2.4 MICRO-SD.1(NC-1) MICRO-SD.8(NC-2) MMA8652FC.8(Z-OUT) MMA8652FC.9(Y-OUT) MMA8652FC.10(X-OUT) MMA8652FC.11(NC1) MMA8652FC.12(NC2) NBPLANN100PAUNV.2(NC1) NBPLANN100PAUNV.3(V-) NBPLANN100PAUNV.5(NC2) SHIFT-REGISTER.-Q7 SHIFT-REGISTER.D3 SHIFT-REGISTER.D4 SMPS.6(NC) SRAM.28(NC-3) USB.4 Y2.2(OUT0) Y2.7(NC1) Y2.8(NC2)

## Notes on the sheet
- Charge-Pump-Supplied 14V Rail
  200 mA @ 50C
- Dispaly Outputs - Each port has
  1xSPI, 3xButton, 2xPWM, 3.3V Rail, 14V Rail
- 9-12V Sup. & Scaled for AN-Input
- Frame Buffer & General Buffer
  4-Mbit SRAM, 120MHz
  8 ns Propogation Delay
- 3.3V Rail
  475-630 mA @ 50C
- 5V Rail
  250 mA @ 50C
- Analog & Digital Grounds
- Analog Inputs: 0-3.3V range
  Source: 5V @ 50 mA per pair
- Impulse Inputs
  RPM, VSS, etc.
- **AN10 & AN11**
  Use uUSB-A Plug for ICSP
- Schematic Capture for D-DAQ
  Version: Proto v4
  Released Under CERN OHL v1.2
- PIC32MX795-Driven Parameter Minitor & Logger
  x14 Analog Inputs, x3 Impulse Inputs
  x3 Display Outputs w/ 4-Mbit SRAM
  SD Card Storage, USB Data Output, CAN Bus
  ICSP & JTAG Programming and Diagnostics
- Solid State Relays - SSRs
  1) Change Press. Sensor Res.
  2) Autodetect for AN Sensors
- AN6&7-to-ICSP Swap
  Plug in uUSB-A Cable
  for ICSP Programming
- Termination of
  Parallel lines
- Outside Communication
  1) uSD Card Storage
  2) CAN Bus Interface
  3) FS USB Port
  4) JTAG Header
- EMI Filtered 3.3V Rail
- Supplies Pins:
  2, 16, 30
- Supplies Pins:
  37, 46, 55
- Supplies Pins:
  62, 86, I2C, SRAM
- (1) | (1) | (2)
- ICSP Pins cannot have
  >100 ohms resistance
  100||470=~82
- 5V-3.3V
  Boost
  Resolution
- 5V-3.3V
  USB
  Autodetect
- 20 MHz, 2 ppm TCXO Oscillator
- On-Board Analog Sensors
  1) 100-psi-a   2) EGT 0-1100C   3) 5V Aux Input
- (3) | (2)
- (1)
- (2)
- (3)
- (4)
- (3)
- (2) | (4)
- (1)
- Digital Input Control
  1) I2C Pullups
  2) Barometer & Thermometer
  3) Accelerometer
  4) Parallel-to-Serial
     Shift Register

## Power pins joined to a net without a drawn wire
P$1: CAN-BUS.1

## Library data of the parts
4&5 8&9 10&11 12&13 IMP-1 IMP-2 = Parts for D-DAQ:105133-0001: Molex Micro-B receptical, perpendicular to board
5V-LDO = Parts for D-DAQ:ZLDO1117-: Adjustable LDO
6&7+ = Parts for D-DAQ:47589-0001: Molex Micro-AB receptical, flat on board
14V-LDO = Parts for D-DAQ:TL1963ADCQR: SOT-223-6 Adjustable LDO
AN6-SHORT AN7-SHORT BOOST-3.3V BOOST-5V ICSP-MCLR ISCP-PWR USB-3.3V USB-5V = Parts for D-DAQ:CPC1?17N: 150 mA Load Solid State Relay CPC1117 is a NC, Normally Closed, Form-B Relay CPC1017 is a NO, Normally Open, Form-A Relay
AUX-PRESS = Parts for D-DAQ:PC-1771101: 3-Terminal Spring Cage Female Header
C1.3 C1.4 C2 C2.3 C2.4 C3 C8 C10-C20 C26 C28 C31 C121 C125 C127 = Parts for D-DAQ:C-: Capacitor
CAN-BUS USB = Parts for D-DAQ:UE25-BE55-10H: Vertical Mini USB Type-B
CF1-CF3 = Parts for D-DAQ:NMF21PS
D2 = Parts for D-DAQ:TFZGTR20B: Schottky Diode
D3 D5 D6 = Parts for D-DAQ:S07D: 100V, 0.7A continuous diode
DISP-1-DISP-3 = Parts for D-DAQ:DP3R020?U32JQ: JAE Mini DisplayPort, aka Thunderbolt; ORIENTATION: Standard
EGT-AMP = Parts for D-DAQ:MAX4239: High Precision & Accuracy OP Amp
EGT-INPUT POWER = Parts for D-DAQ:PC-1702610: Press Fit Phoenix Connect 2-wire Terminal Block
F1 F2 F4 F5 F15-F25 L2-L4 R1-R47 R130 R131 R138-R141 = Parts for D-DAQ:R-: Resistor
JTAG = Parts for D-DAQ:HEADER-X?: Modified Pin Header Instead fo staggering hold to align header, holes are shrunk to 0.8 mm
L1 = Parts for D-DAQ:WE-INDUCTOR: Wurth Electronics WE-HCI Series Inductor
LATCH-HIGH LATCH-LOW = Parts for D-DAQ:74LVC573A: 74LVC573A, 8.5 ns @ 3.3 V Octal Transparent D-type latch
MICRO-SD = Parts for D-DAQ:MICRO-SD-SLOT: MicroSD Receptacle Low profile and clearence slot with Card Detect pins
MMA8652FC = Parts for D-DAQ:MMA8491Q: Digital Accelerometer: 3-axis, 12-bit
MPL3115A = Parts for D-DAQ:MPL3115A2: I2C Barometric Pressure & Ambient Temperature sensor
NBPLANN100PAUNV = Parts for D-DAQ:NBP-SENSORS: Boost Pressure sensor
PIC32MX = Parts for D-DAQ:PIC32MX795F512L-80I/P: PIC32MX795 Microcontroller
SHIFT-REGISTER = Parts for D-DAQ:NXP-74HC165
SMPS = Parts for D-DAQ:MP2209: 2A Buck SMPS Regulator
SRAM = Parts for D-DAQ:IS61WV25616ALL
Y1 = Parts for D-DAQ:XTC7009: 16.368 MEMS Oscillator 0.2 ppm, -30˚C to 85˚C
Y2 = Parts for D-DAQ:DS1099: Programmable Oscilator Frequency range from 0.25Hz to 1.048MHz, in powers of 2, set at factory

## Net classes
0 min: width 0.152 mm, drill 0.33 mm, clearance 0.152 mm
1 analog: width 0.254 mm, drill 0.381 mm, clearance 0.254 mm
2 digital: width 0.203 mm, drill 0.381 mm, clearance 0.203 mm
3 power-low: width 0.406 mm, drill 0.381 mm, clearance 0.254 mm
4 power-med: width 0.61 mm, drill 0.508 mm, clearance 0.406 mm
5 power-hi: width 0.813 mm, drill 0.635 mm, clearance 0.508 mm